# EAGLE schematic MIT SRAM (EAGLE 9.5.2)
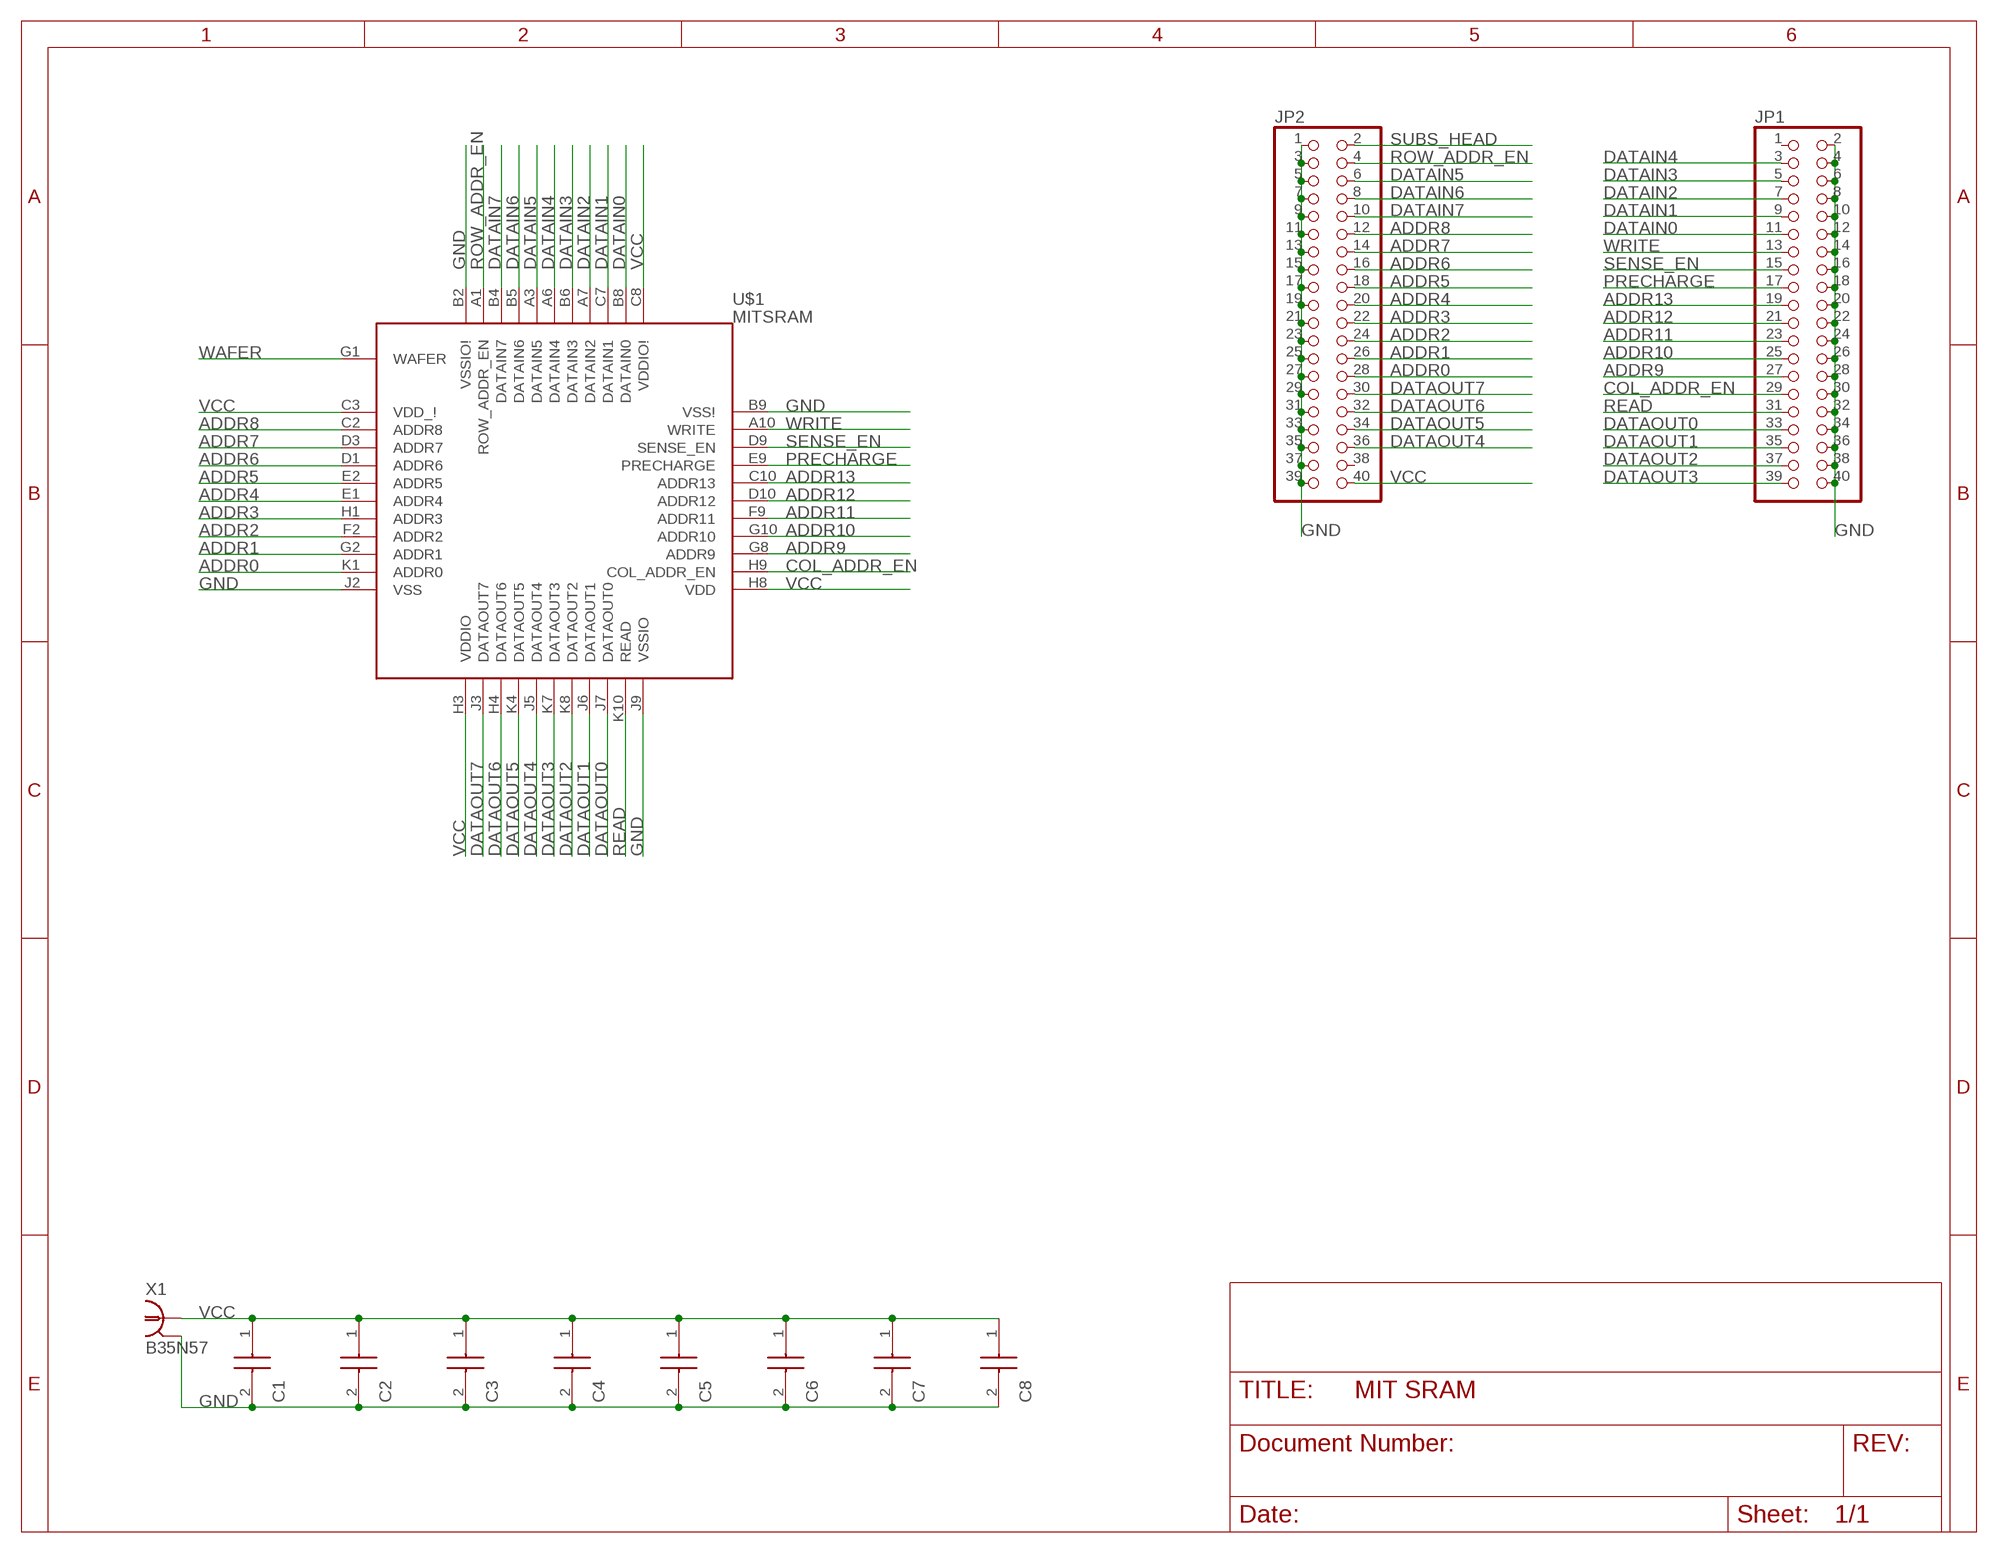
[diagram p0: schematic, sheet 1]

## Parts
C1  K104K15X7RF53H5  [K104K15X7RF53H5]
C2  K104K15X7RF53H5  [K104K15X7RF53H5]
C3  K104K15X7RF53H5  [K104K15X7RF53H5]
C4  K104K15X7RF53H5  [K104K15X7RF53H5]
C5  K104K15X7RF53H5  [K104K15X7RF53H5]
C6  K104K15X7RF53H5  [K104K15X7RF53H5]
C7  K104K15X7RF53H5  [K104K15X7RF53H5]
C8  K104K15X7RF53H5  [K104K15X7RF53H5]
JP1  PINHD-2X20  [2X20]
JP2  PINHD-2X20  [2X20]
U$1  MITSRAM  [BGA100C50P10X10_600X600X100N]
X1  B35N57  [B35N57]

## Nets
ADDR0: JP2.28 U$1.K1(ADDR0)
ADDR1: JP2.26 U$1.G2(ADDR1)
ADDR2: JP2.24 U$1.F2(ADDR2)
ADDR3: JP2.22 U$1.H1(ADDR3)
ADDR4: JP2.20 U$1.E1(ADDR4)
ADDR5: JP2.18 U$1.E2(ADDR5)
ADDR6: JP2.16 U$1.D1(ADDR6)
ADDR7: JP2.14 U$1.D3(ADDR7)
ADDR8: JP2.12 U$1.C2(ADDR8)
ADDR9: JP1.27 U$1.G8(ADDR9)
ADDR10: JP1.25 U$1.G10(ADDR10)
ADDR11: JP1.23 U$1.F9(ADDR11)
ADDR12: JP1.21 U$1.D10(ADDR12)
ADDR13: JP1.19 U$1.C10(ADDR13)
COL_ADDR_EN: JP1.29 U$1.H9(COL_ADDR_EN)
DATAIN0: JP1.11 U$1.B8(DATAIN0)
DATAIN1: JP1.9 U$1.C7(DATAIN1)
DATAIN2: JP1.7 U$1.A7(DATAIN2)
DATAIN3: JP1.5 U$1.B6(DATAIN3)
DATAIN4: JP1.3 U$1.A6(DATAIN4)
DATAIN5: JP2.6 U$1.A3(DATAIN5)
DATAIN6: JP2.8 U$1.B5(DATAIN6)
DATAIN7: JP2.10 U$1.B4(DATAIN7)
DATAOUT0: JP1.33 U$1.J7(DATAOUT0)
DATAOUT1: JP1.35 U$1.J6(DATAOUT1)
DATAOUT2: JP1.37 U$1.K8(DATAOUT2)
DATAOUT3: JP1.39 U$1.K7(DATAOUT3)
DATAOUT4: JP2.36 U$1.J5(DATAOUT4)
DATAOUT5: JP2.34 U$1.K4(DATAOUT5)
DATAOUT6: JP2.32 U$1.H4(DATAOUT6)
DATAOUT7: JP2.30 U$1.J3(DATAOUT7)
GND: C1.2 C2.2 C3.2 C4.2 C5.2 C6.2 C7.2 C8.2 JP1.2 JP1.4 JP1.6 JP1.8 JP1.10 JP1.12 JP1.14 JP1.16 JP1.18 JP1.20 JP1.22 JP1.24 JP1.26 JP1.28 JP1.30 JP1.32 JP1.34 JP1.36 JP1.38 JP1.40 JP2.1 JP2.3 JP2.5 JP2.7 JP2.9 JP2.11 JP2.13 JP2.15 JP2.17 JP2.19 JP2.21 JP2.23 JP2.25 JP2.27 JP2.29 JP2.31 JP2.33 JP2.35 JP2.37 JP2.39 U$1.B2(VSSIO!) U$1.B9(VSS!) U$1.J2(VSS) U$1.J9(VSSIO) X1.2 X1.3 X1.4 X1.5
PRECHARGE: JP1.17 U$1.E9(PRECHARGE)
READ: JP1.31 U$1.K10(READ)
ROW_ADDR_EN: JP2.4 U$1.A1(ROW_ADDR_EN)
SENSE_EN: JP1.15 U$1.D9(SENSE_EN)
SUBS_HEAD: JP2.2
VCC: C1.1 C2.1 C3.1 C4.1 C5.1 C6.1 C7.1 C8.1 JP2.40 U$1.C3(VDD_!) U$1.C8(VDDIO!) U$1.H3(VDDIO) U$1.H8(VDD) X1.1
WAFER: U$1.G1(WAFER)
WRITE: JP1.13 U$1.A10(WRITE)
Unconnected: JP1.1 JP2.38

## Library data of the parts
C1-C8 = K104K15X7RF53H5:K104K15X7RF53H5: Capacitor;Ceramic;Cap 0.1 uF Vishay K 100nF Ceramic Multilayer Capacitor, 50 V dc, +125C, X7R Dielectric, +/-10% Source: Datasheet <http://www.vishay.com/docs/45171/kseries.pdf>; ALLIED_NUMBER: 70123004; ALLIED_PRICE-STOCK: https://www.alliedelec.com/bc-components-vishay-k104k15x7rf53h5/70123004/; DESCRIPTION: Capacitor;Ceramic;Cap 0.1 uF Vishay K 100nF Ceramic Multilayer Capacitor, 50 V dc, +125C, X7R Dielectric, +/-10%; HEIGHT: mm; MANUFACTURER_NAME: Vishay; MANUFACTURER_PART_NUMBER: K104K15X7RF53H5; MOUSER_PART_NUMBER: 594-K104K15X7RF53H5; MOUSER_PRICE-STOCK: https://www.mouser.com/Search/Refine.aspx?Keyword=594-K104K15X7RF53H5; RS_PART_NUMBER: 8523270; RS_PRICE-STOCK: http://uk.rs-online.com/web/p/products/8523270
JP1 JP2 = pinhead:PINHD-2X20: PIN HEADER
U$1 = BGA100C50P10X10_600X600X100N:MITSRAM
X1 = con-coax:B35N57: BNC CONNECTOR M/A COM www.macom.com; OC_FARNELL: unknown; OC_NEWARK: unknown